# EAGLE design button_board (EAGLE 9.6.2)
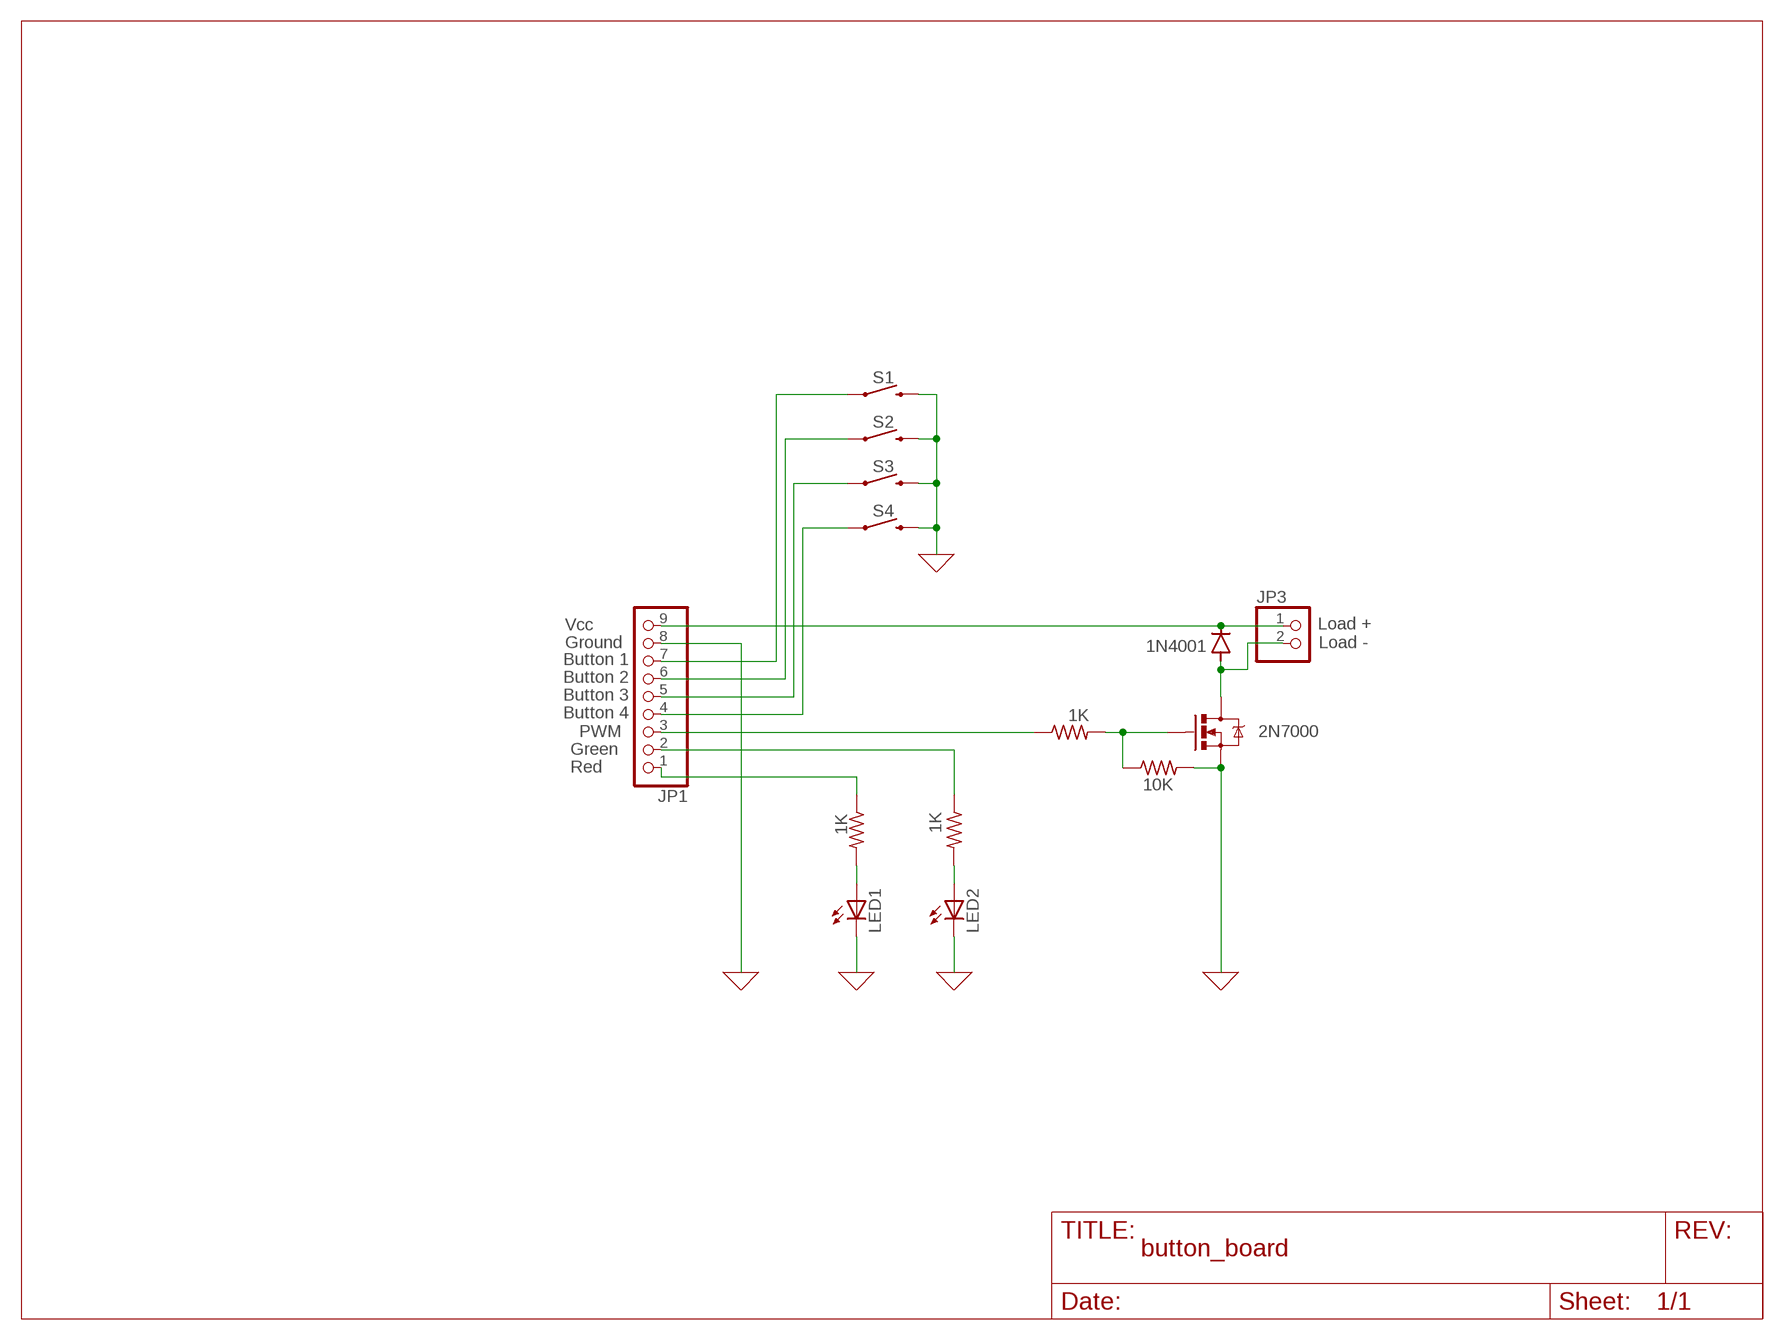
[diagram p0: schematic, sheet 1]

## Parts
D1  1N4001  1N4004  [DO-41]
JP1  PINHD-1X9  [1X09]
JP3  PINHD-1X2  [1X02]
LED1  LED5MM  [LED5MM]
LED2  LED5MM  [LED5MM]
Q1  MOSFET-NCHANNEL2N7000  [TO-92]
R1  1K  R-US_0207/10  [0207/10]
R2  10K  R-US_0207/10  [0207/10]
R3  1K  R-US_0207/10  [0207/10]
R4  1K  R-US_0207/10  [0207/10]
S1  MOMENTARY-SWITCH-SPST-PTH-6.0MM  [TACTILE_SWITCH_PTH_6.0MM]
S2  MOMENTARY-SWITCH-SPST-PTH-6.0MM  [TACTILE_SWITCH_PTH_6.0MM]
S3  MOMENTARY-SWITCH-SPST-PTH-6.0MM  [TACTILE_SWITCH_PTH_6.0MM]
S4  MOMENTARY-SWITCH-SPST-PTH-6.0MM  [TACTILE_SWITCH_PTH_6.0MM]

## Nets
0: JP1.8 LED1.K(C) LED2.K(C) Q1.1(S) R2.2 S1.3 S2.3 S3.3 S4.3 ; supply symbol labelled GND
N$1: JP1.3 R1.1
N$2: Q1.2(G) R1.2 R2.1
N$3: D1.A JP3.2 Q1.3(D)
N$5: JP1.7 S1.1
N$6: JP1.6 S2.1
N$7: JP1.5 S3.1
N$8: JP1.4 S4.1
N$9: JP1.1 R3.1
N$10: JP1.2 R4.1
N$11: LED2.A R4.2
N$12: LED1.A R3.2
N$13: D1.C JP1.9 JP3.1

## Notes on the sheet
- Vcc | Load +
- Ground | Load -
- Button 1
- Button 2
- Button 3
- Button 4
- PWM | 2N7000
- Green
- Red

## Library data of the parts
D1 = Diodes:1N4004: DIODE GEN PURP 400V 1A DO41 Manufacturer's datasheet <https://www.mccsemi.com/pdf/Products/1N4001-1N4007(DO-41).pdf>; CREATED_BY: PCBLayout.com; DIGIKEY_PART_NUMBER: 1N4004MSCT-ND; MANUFACTURER: Micro Commercial Co; MPN: 1N4004; PACKAGE: DO-41
JP1 = pinhead:PINHD-1X9: PIN HEADER
JP3 = pinhead:PINHD-1X2: PIN HEADER
LED1 LED2 = adafruit:LED: LED OSRAM: - CHIPLED LG R971, LG N971, LY N971, LG Q971, LY Q971, LO R971, LY R971 LH N974, LH R974 LS Q976, LO Q976, LY Q976 LO Q996 - Hyper CHIPLED LW Q18S LB Q993, LB Q99A, LB R99A - SideLED LS A670, LO A670, LY A670, LG A670, LP A670 LB A673, LV A673, LT A673, LW A673 LH A674 LY A675 LS A676, LA A676, LO A676, LY A676, LW A676 LS A679, LY A679, LG A679 - Hyper Micro SIDELED® LS Y876, LA Y876, LO Y876, LY Y876 LT Y87S - SmartLED LW L88C, LW L88S LB L89C, LB L89S, LG L890 LS L89K, LO L89K, LY L89K LS L896, LA L896, LO L896, LY L896 - TOPLED LS T670, LO T670, LY T670, LG T670, LP T670 LSG T670, LSP T670, LSY T670, LOP T670, LYG T670 LG T671, LOG T671, LSG T671 LB T673, LV T673, LT T673, LW T673 LH T674 LS T676, LA T676, LO T676, LY T676, LB T676, LH T676, LSB T676, LW T676 LB T67C, LV T67C, LT T67C, LS T67K, LO T67K, LY T67K, LW E67C LS E67B, LA E67B, LO E67B, LY E67B, LB E67C, LV E67C, LT E67C LW T67C LS T679, LY T679, LG T679 LS T770, LO T770, LY T770, LG T770, LP T770 LB T773, LV T773, LT T773, LW T773 LH T774 LS E675, LA E675, LY E675, LS T675 LS T776, LA T776, LO T776, LY T776, LB T776 LHGB T686 LT T68C, LB T68C - Hyper Mini TOPLED® LB M676 - Mini TOPLED Santana® LG M470 LS M47K, LO M47K, LY M47K Source: http://www.osram.convergy.de/
Q1 = digikey:MOSFET-NCHANNEL: Common NMOSFET Parts MFG P/N Store ID Prod ID FDD8780 TRANS-09984 SI7820DN TRANS-11055 FDS6630A IC-08089 2N7002PW TRANS-11151 FQP30N06L COM-10213 TRANS-10060 BSS123LT1G TRANS-08345 BSS138 TRANS-00830 BS170 2N7000
R1-R4 = adafruit:R-US_: RESISTOR, American symbol
S1-S4 = SparkFun-Switches:MOMENTARY-SWITCH-SPST: Momentary Switch (Pushbutton) - SPST Normally-open (NO) SPST momentary switches (buttons, pushbuttons). Variants PTH-12MM - 12mm square, through-hole Momentary Pushbutton Switch - 12mm Square <https://www.sparkfun.com/products/9190> (COM-09190) PTH-6.0MM, PTH-6.0MM-KIT - 6.0mm square, through-hole Mini Pushbutton Switch <https://www.sparkfun.com/products/97> (COM-00097) KIT package intended for soldering kit's - only one side of pads' copper is exposed. PTH-RIGHT-ANGLE-KIT - Right-angle, through-hole Right Angle Tactile Button <https://www.sparkfun.com/products/10791> - Used on SparkFun BigTime Watch Kit <https://www.sparkfun.com/products/11734> SMD-12MM - 12mm square, surface-mount Tactile Button - SMD (12mm) <https://www.sparkfun.com/products/12993> (COM-12993) Used on SparkFun PicoBoard <https://www.sparkfun.com/products/11888> SMD-4.5MM - 4.5mm Square Trackball Switch Used on SparkFun Blackberry Trackballer Breakout <https://www.sparkfun.com/products/13169> SMD-4.6MMX2.8MM - 4.60mm x 2.80mm, surface mount Used on SparkFun SAMD21 Mini Breakout <https://www.sparkfun.com/products/13664> SMD-5.2MM, SMD-5.2-REDUNDANT - 5.2mm square, surface-mount Mini Pushbutton Switch - SMD <https://www.sparkfun.com/products/8720> (COM-08720) Used on Arduino Pro Mini <https://www.sparkfun.com/products/11114> REDUNDANT package connects both switch circuits together SMD-6.0X3.5MM - 6.0 x 3.5mm, surface mount Momentary Reset Switch SMD <https://www.sparkfun.com/products/8229> (COM-08229) SMD-6.2MM-TALL - 6.2mm square, surface mount Tactile Button - SMD (6mm) <https://www.sparkfun.com/products/12992> Used on SparkFun Digital Sandbox <https://www.sparkfun.com/products/12651> SMD-RIGHT-ANGLE - Right-angle, surface mount Used on SparkFun Block for Intel® Edison - Arduino <https://www.sparkfun.com/products/13036>; PROD_ID: SWCH-08441; SF_SKU: COM-00097

## Board
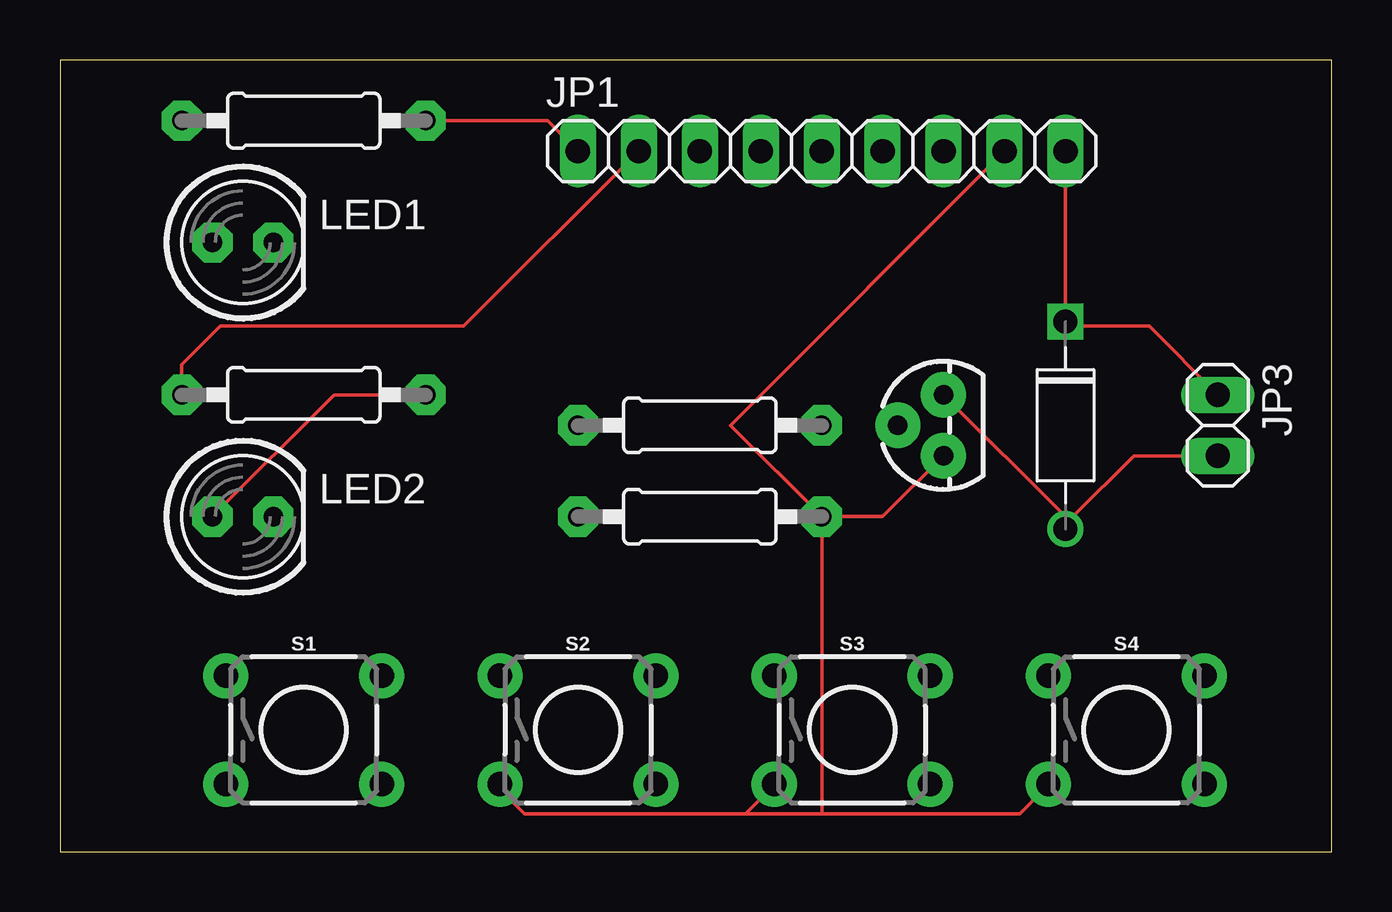
[diagram p1: board, top side]
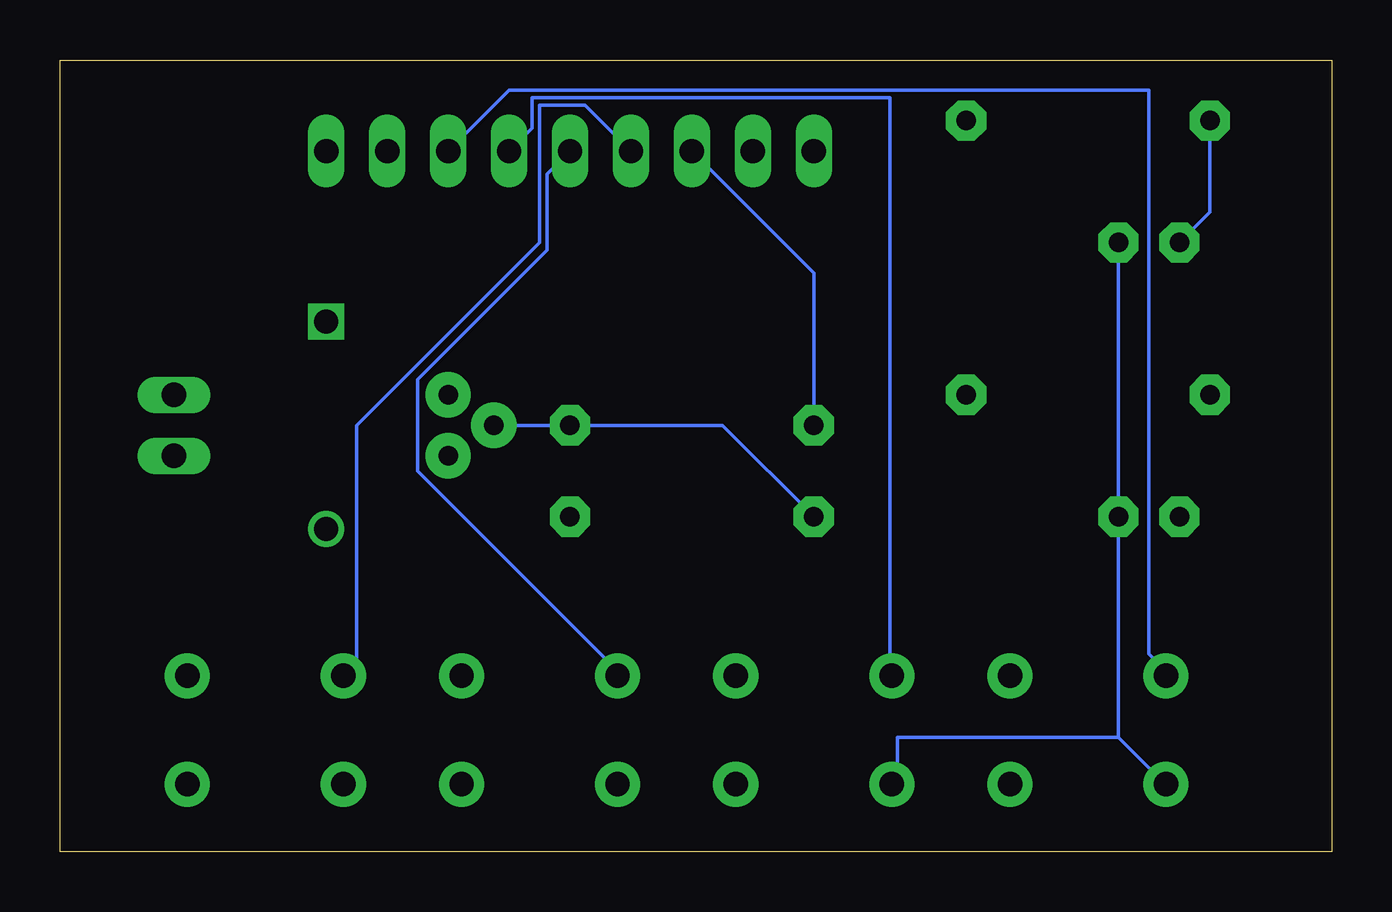
[diagram p2: board, bottom side, seen from below]

Size 53.01 x 33.01 mm. Coordinates in mm from the lower left corner, seen from the top.
Outline: 0,0 53.01,0 53.01,33.01 0,33.01 0,0
Copper layers (1*16): Top 0.035mm / dielectric 1.5mm / Bottom 0.035mm
Design rules "default": minimum track width 6mil, minimum drill 0.35mm, track to track 6mil, track to pad 6mil, pad to pad 6mil, via to via 6mil, smd to smd 6mil, copper to edge 40mil, drill to drill 6mil, minimum pad ring 10mil, minimum via ring 8mil, stop-mask expansion 4mil, vias tented up to drill 0mil, thermal gap 10mil

### Footprints (pad centres in the part's own frame; a part is rotated, then mirrored left to right if it is on the bottom)
DO-41 = drill 1: A 4.325,0 | drill 1 square: C -4.325,0
1X09 = drill 1.016 long: 1 -10.16,0; 2 -7.62,0; 3 -5.08,0; 4 -2.54,0; 5 0,0; 6 2.54,0; 7 5.08,0; 8 7.62,0; 9 10.16,0
1X02 = drill 1.016 long: 1 -1.27,0; 2 1.27,0
LED5MM = drill 0.813 pad 1.676 octagon: A -1.27,0; K 1.27,0
TO-92 = drill 0.813 pad 1.88: 1 -1.27,0; 2 0,1.905; 3 1.27,0
0207/10 = drill 0.813 pad 1.676 octagon: 1 -5.08,0; 2 5.08,0
TACTILE_SWITCH_PTH_6.0MM = drill 1.016 pad 1.88: 1 -3.251,2.261; 2 3.251,2.261; 3 -3.251,-2.261; 4 3.251,-2.261

### Placement (x,y rotation side)
D1  41.91,17.78 270 top
JP1  31.75,29.21 0 top
JP3  48.26,17.78 270 top
LED1  7.62,25.4 0 top
LED2  7.62,13.97 0 top
Q1  36.83,17.78 90 top
R1  26.67,17.78 0 top
R2  26.67,13.97 0 top
R3  10.16,30.48 180 top
R4  10.16,19.05 0 top
S1  10.16,5.08 0 top
S2  21.59,5.08 0 top
S3  33.02,5.08 0 top
S4  44.45,5.08 0 top

### Tracks (layer width: path | path; a pad name or v marks a point on that pad's centre or on a via)
0
  Top 0.152: Q1.1 34.29,13.97 R2.2 | R2.2 27.94,17.78 JP1.8 | 28.57,1.59 19.37,1.59 18.41,2.54 S2.3 | 28.57,1.59 29.53,2.54 S3.3 | 28.57,1.59 31.75,1.59 | 31.75,1.59 40.01,1.59 40.96,2.54 S4.3 | 31.75,1.59 R2.2
  Bottom 0.152: LED1.K LED2.K 8.89,4.76 | 8.89,4.76 6.99,2.86 S1.3 | 8.89,4.76 18.1,4.76 18.1,2.86 S2.3
N$1
  Bottom 0.152: JP1.3 21.59,24.13 R1.1
N$2
  Bottom 0.152: R2.1 25.4,17.78 R1.2 Q1.2
N$3
  Top 0.152: 42.23,13.97 44.77,16.51 JP3.2 | 42.23,13.97 41.91,13.65 D1.A 42.23,13.97 | Q1.3 41.91,13.97 42.23,13.97
N$5
  Bottom 0.152: JP1.7 34.29,31.75 7.62,31.75 7.62,8.25 6.99,7.62 S1.1
N$6
  Bottom 0.152: JP1.6 33.34,30.16 33.34,31.43 18.41,31.43 18.41,7.62 S2.1
N$7
  Bottom 0.152: JP1.5 32.7,28.26 32.7,25.08 38.1,19.68 38.1,15.88 29.84,7.62 S3.1
N$8
  Bottom 0.152: JP1.4 31.11,31.12 33.02,31.12 33.02,25.4 40.64,17.78 40.64,7.94 40.96,7.62 S4.1
N$9
  Top 0.152: JP1.1 20.32,30.48 R3.1
N$10
  Top 0.152: JP1.2 16.83,21.91 6.67,21.91 5.08,20.32 R4.1
N$11
  Top 0.152: LED2.A 11.43,19.05 R4.2
N$12
  Bottom 0.152: LED1.A 5.08,26.67 R3.2
N$13
  Top 0.152: JP1.9 D1.C 41.91,21.91 45.4,21.91 JP3.1